# Altium project TIK_SIMULATIONS.PrjPcb
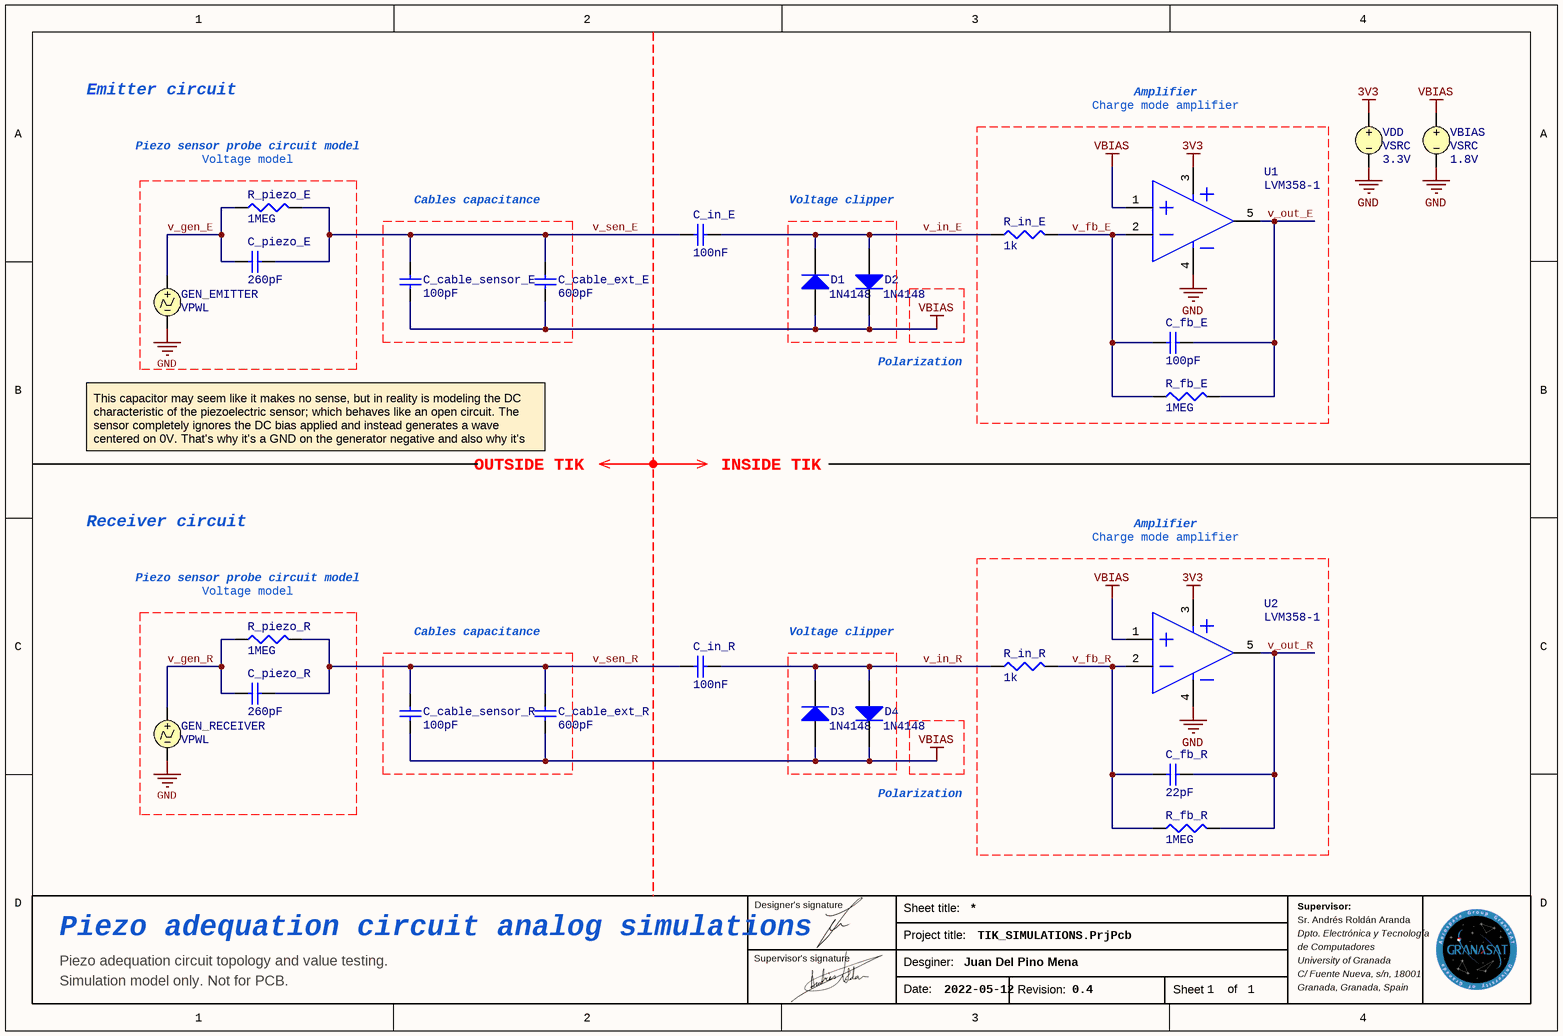
[diagram p0: conditioning_circuit.SchDoc]
ProjectAuthor: Juan Del Pino Mena; ProjectDate: 2022-05-12; ProjectRevision: 0.4
1 sheet, 26 parts. Net scope: global (net labels, ports and power ports of the same name join across sheets).

## Sheet conditioning_circuit.SchDoc
size A4; SheetNumber: 1; SheetTotal: 1; TitleBig: Piezo adequation circuit analog simulations; Desc_line1: Piezo adequation circuit topology and value testing.; Desc_line2: Simulation model only. Not for PCB.; SPICEModelCacheTSNVVPPP: <root> / <DocumentId>TSNVVPPP</DocumentId> / <CacheFrame Number="0"> / <Model Name="lmv358" Kind="ckt"> / <Text>.SUBCKT  lmv358     3  2  4  5  6 / * Features: / * 2.7V and 5V Operation / * Low Supply Current:  105uA per Channel at VCC=5V / * Stable for AV = +1 / * Note:  Model is for single device only and simulated / *	 supply current is 1/2 of the total device current. / *///////////////////////////////////////// / ************************************** / EOX 120 10 31 32 2.0 / RCX 120 121 1K / RDX 121 10 1K / RBX 120 122 1K / GOS 10 57 122 121 1.0 / RVOS 31 32 1K / RINB 2 18 1000 / RINA 3 19 1000 / DIN1 5 18 DMOD2 / DIN2 18 4 DMOD2 / DIN3 5 19 DMOD2 / DIN4 19 4 DMOD2 / EXX 10 5 17 5 1.0 / EEE 10 50 17 5 1.0 / ECC 40 10 4 17 1.0 / RAA 4 17 100MEG / RBB 17 5 100MEG / ISET 10 24 1e-3 / DA1 24 23 DMOD1 / RBAL 23 22 1000 / ESUPP 22 21 4 5 1.0 / VOFF 21 10 -1.25 / DA2 24 25 DMOD1 / VSENS1 25 26 DC 0 / RSET 26 10 1K / CSET 26 10 1e-10 / FSET 10 31 VSENS1 1.0 / R001 34 10 1K / FTEMP 10 27 VSENS1 1.0 / DTA 27 10 DMOD2 / DTB 28 29 DMOD2 / VTEMP 29 10 DC 0 / ECMR 38 10 11 10 1.0 / VCMX 38 39 DC 0 / RCM2 41 10 1MEG / EPSR 42 10 4 10 1.0 / CDC1 43 42 10U / VPSX 43 44 DC 0 / RPSR2 45 10 1MEG / FCXX 57 10 VCXX 100 / DCX1 98 97 DMOD1 / DCX2 95 94 DMOD1 / RCX1 99 98 100 / RCX2 94 99 100 / VCXX 99 96 DC 0 / ECMX 96 10 11 10 1.0 / DLIM1 52 57 DMOD1 / DLIM2 57 51 DMOD1 / ELIMP 51 10 26 10 99.3 / GDM 10 57 3 2 1 / C1 58 59 1e-10 / DCLMP2 59 40 DMOD1 / DCLMP1 50 59 DMOD1 / RO2 59 10 1K / GO3 10 71 59 10 1 / RO3 71 10 1 / DDN1 73 74 DMOD1 / DDN2 73 710 DMOD1 / DDP1 75 72 DMOD1 / DDP2 71 720 DMOD1 / RDN2 710 71 100 / RDP 720 72 100 / VOOP 40 76 DC 0 / VOON 77 50 DC 0 / QNO 76 73 78 NPN1 / QNP 77 72 79 PNP1 / RNO 78 81 1 / RPO 79 81 1 / VOX 86 6 DC 0 / RNT 76 81 100MEG / RPT 81 77 1MEG / FX 10 93 VOX 1.0 / DFX1 93 91 DMOD1 / VFX1 91 10 DC 0 / DFX2 92 93 DMOD1 / VFX2 10 92 DC 0 / FPX 4 10 VFX1 1.0 / FNX 10 5 VFX2 1.0 / RAX 122 10 MRAX 1.014000e+03 / * Input Offset Voltage / .MODEL MRAX RES (TC1=1e-05) / FIN1 18 5 VTEMP 0.833333 / FIN2 19 5 VTEMP 1.16667 / * Input Bias Currents / CIN1 2 10 1e-12 / CIN2 3 10 1e-12 / * Common Mode Input Capacitance / RD1 18 11 5e+08 / RD2 19 11 5e+08 / * Diff. Input Resistance / RCM 11 10 9.75e+09 / * Common Mode Input Resistance / FCMR 10 57 VCMX 562.341 / * Low Freq. CMRR / FPSR 10 57 VPSX 2000 / * Low Freq. PSRR / RSLOPE 4 5 1e+12 / * Slope of Supp. Curr. vs. Supp. Volt. / GPWR 4 5 26 10 0.000105 / * Quiescent Supply Current / ETEMP 27 28 32 33 0.286906 / RIB 32 33 MRIB 1K / * Temp. Co. of Input Currents / .MODEL MRIB RES (TC1=0.00283713) / RISC 33 34 MRISC 1K / .MODEL MRISC RES (TC1=-0.003) / RCM1 39 41 17782.8 / CCM 41 10 5.30516e-12 / * CMRR vs. Freq. / RPSR1 44 45 10000 / CPSR 45 10 5.30516e-11 / * PSRR vs. Freq. / ELIMN 10 52 26 10 99.3 / RDM 57 10 725.52 / C2 57 10 1.09683e-10 / ECMP 40 97 26 10 0.8 / ECMN 95 50 26 10 0.2 / G2 58 10 57 10 1e-06 / R2 58 10 1378.32 / GO2 59 10 58 10 100 / * Avol and Slew-Rate Settings / EPOS 40 74 26 10 0 / ENEG 75 50 26 10 0.01 / * Output Voltage Swing Settings / GSOURCE 74 73 33 34 0.0006 / GSINK 72 75 33 34 0.0016 / * Output Current Settings / ROO 81 86 8.5 / .MODEL DMOD1 D / .MODEL DMOD2 D  (IS=1e-17) / .MODEL NPN1 NPN (BF=100 IS=1e-15) / .MODEL PNP1 PNP (BF=100 IS=1e-15) / .ENDS lmv358</Text> / </Model> / </CacheFrame> / <CacheFrame Number="1"> / <Model Name="lmv358" Kind="ckt"> / <Text>.SUBCKT  lmv358     3  2  4  5  6 / * Features: / * 2.7V and 5V Operation / * Low Supply Current:  105uA per Channel at VCC=5V / * Stable for AV = +1 / * Note:  Model is for single device only and simulated / *    supply current is 1/2 of the total device current. / *///////////////////////////////////////// / ************************************** / EOX 120 10 31 32 2.0 / RCX 120 121 1K / RDX 121 10 1K / RBX 120 122 1K / GOS 10 57 122 121 1.0 / RVOS 31 32 1K / RINB 2 18 1000 / RINA 3 19 1000 / DIN1 5 18 DMOD2 / DIN2 18 4 DMOD2 / DIN3 5 19 DMOD2 / DIN4 19 4 DMOD2 / EXX 10 5 17 5 1.0 / EEE 10 50 17 5 1.0 / ECC 40 10 4 17 1.0 / RAA 4 17 100MEG / RBB 17 5 100MEG / ISET 10 24 1e-3 / DA1 24 23 DMOD1 / RBAL 23 22 1000 / ESUPP 22 21 4 5 1.0 / VOFF 21 10 -1.25 / DA2 24 25 DMOD1 / VSENS1 25 26 DC 0 / RSET 26 10 1K / CSET 26 10 1e-10 / FSET 10 31 VSENS1 1.0 / R001 34 10 1K / FTEMP 10 27 VSENS1 1.0 / DTA 27 10 DMOD2 / DTB 28 29 DMOD2 / VTEMP 29 10 DC 0 / ECMR 38 10 11 10 1.0 / VCMX 38 39 DC 0 / RCM2 41 10 1MEG / EPSR 42 10 4 10 1.0 / CDC1 43 42 10U / VPSX 43 44 DC 0 / RPSR2 45 10 1MEG / FCXX 57 10 VCXX 100 / DCX1 98 97 DMOD1 / DCX2 95 94 DMOD1 / RCX1 99 98 100 / RCX2 94 99 100 / VCXX 99 96 DC 0 / ECMX 96 10 11 10 1.0 / DLIM1 52 57 DMOD1 / DLIM2 57 51 DMOD1 / ELIMP 51 10 26 10 99.3 / GDM 10 57 3 2 1 / C1 58 59 1e-10 / DCLMP2 59 40 DMOD1 / DCLMP1 50 59 DMOD1 / RO2 59 10 1K / GO3 10 71 59 10 1 / RO3 71 10 1 / DDN1 73 74 DMOD1 / DDN2 73 710 DMOD1 / DDP1 75 72 DMOD1 / DDP2 71 720 DMOD1 / RDN2 710 71 100 / RDP 720 72 100 / VOOP 40 76 DC 0 / VOON 77 50 DC 0 / QNO 76 73 78 NPN1 / QNP 77 72 79 PNP1 / RNO 78 81 1 / RPO 79 81 1 / VOX 86 6 DC 0 / RNT 76 81 100MEG / RPT 81 77 1MEG / FX 10 93 VOX 1.0 / DFX1 93 91 DMOD1 / VFX1 91 10 DC 0 / DFX2 92 93 DMOD1 / VFX2 10 92 DC 0 / FPX 4 10 VFX1 1.0 / FNX 10 5 VFX2 1.0 / RAX 122 10 MRAX 1.014000e+03 / * Input Offset Voltage / .MODEL MRAX RES (TC1=1e-05) / FIN1 18 5 VTEMP 0.833333 / FIN2 19 5 VTEMP 1.16667 / * Input Bias Currents / CIN1 2 10 1e-12 / CIN2 3 10 1e-12 / * Common Mode Input Capacitance / RD1 18 11 5e+08 / RD2 19 11 5e+08 / * Diff. Input Resistance / RCM 11 10 9.75e+09 / * Common Mode Input Resistance / FCMR 10 57 VCMX 562.341 / * Low Freq. CMRR / FPSR 10 57 VPSX 2000 / * Low Freq. PSRR / RSLOPE 4 5 1e+12 / * Slope of Supp. Curr. vs. Supp. Volt. / GPWR 4 5 26 10 0.000105 / * Quiescent Supply Current / ETEMP 27 28 32 33 0.286906 / RIB 32 33 MRIB 1K / * Temp. Co. of Input Currents / .MODEL MRIB RES (TC1=0.00283713) / RISC 33 34 MRISC 1K / .MODEL MRISC RES (TC1=-0.003) / RCM1 39 41 17782.8 / CCM 41 10 5.30516e-12 / * CMRR vs. Freq. / RPSR1 44 45 10000 / CPSR 45 10 5.30516e-11 / * PSRR vs. Freq. / ELIMN 10 52 26 10 99.3 / RDM 57 10 725.52 / C2 57 10 1.09683e-10 / ECMP 40 97 26 10 0.8 / ECMN 95 50 26 10 0.2 / G2 58 10 57 10 1e-06 / R2 58 10 1378.32 / GO2 59 10 58 10 100 / * Avol and Slew-Rate Settings / EPOS 40 74 26 10 0 / ENEG 75 50 26 10 0.01 / * Output Voltage Swing Settings / GSOURCE 74 73 33 34 0.0006 / GSINK 72 75 33 34 0.0016 / * Output Current Settings / ROO 81 86 8.5 / .MODEL DMOD1 D / .MODEL DMOD2 D  (IS=1e-17) / .MODEL NPN1 NPN (BF=100 IS=1e-15) / .MODEL PNP1 PNP (BF=100 IS=1e-15) / .ENDS lmv358</Text> / </Model> / </CacheFrame> / </root>

### Parts
C_cable_ext_E  value 600pF  [C1206]  (hidden comment: Cap Semi)
C_cable_ext_R  value 600pF  [C1206]  (hidden comment: Cap Semi)
C_cable_sensor_E  value 100pF  [C1206]  (hidden comment: Cap Semi)
C_cable_sensor_R  value 100pF  [C1206]  (hidden comment: Cap Semi)
C_fb_E  value 100pF  [C1206]  (hidden comment: Cap Semi)
C_fb_R  value 22pF  [C1206]  (hidden comment: Cap Semi)
C_in_E  value 100nF  [C1206]  (hidden comment: Cap Semi)
C_in_R  value 100nF  [C1206]  (hidden comment: Cap Semi)
C_piezo_E  value 260pF  [C1206]  (hidden comment: Cap Semi)
C_piezo_R  value 260pF  [C1206]  (hidden comment: Cap Semi)
D1  1N4148  [DO-35]
D2  1N4148  [DO-35]
D3  1N4148  [DO-35]
D4  1N4148  [DO-35]
GEN_EMITTER  VPWL
GEN_RECEIVER  VPWL
R_fb_E  value 1MEG  [J1-0603]  (hidden comment: Res3)
R_fb_R  value 1MEG  [J1-0603]  (hidden comment: Res3)
R_in_E  value 1k  [J1-0603]  (hidden comment: Res3)
R_in_R  value 1k  [J1-0603]  (hidden comment: Res3)
R_piezo_E  value 1MEG  [J1-0603]  (hidden comment: Res3)
R_piezo_R  value 1MEG  [J1-0603]  (hidden comment: Res3)
U1  Part: LVM358-1  (hidden comment: LMV358)
U2  Part: LVM358-1  (hidden comment: LMV358)
VBIAS  VSRC  value 1.8V
VDD  VSRC  value 3.3V

### Blocks framed on the sheet
Charge mode amplifier: C_fb_E R_fb_E R_in_E U1
Voltage model: C_piezo_E GEN_EMITTER R_piezo_E
Cables capacitance: C_cable_ext_E C_cable_sensor_E
Voltage clipper: D1 D2
Charge mode amplifier: C_fb_R R_fb_R R_in_R U2
Voltage model: C_piezo_R GEN_RECEIVER R_piezo_R
Cables capacitance: C_cable_ext_R C_cable_sensor_R
Voltage clipper: D3 D4

### Nets
3V3: U1.3(VSUP+) U2.3(VSUP+) VDD.1
GND: GEN_EMITTER.2 GEN_RECEIVER.2 U1.4(VSUP-) U2.4(VSUP-) VBIAS.2 VDD.2
VBIAS: C_cable_ext_E.1 C_cable_ext_R.1 C_cable_sensor_E.1 C_cable_sensor_R.1 D1.1(A) D2.2(K) D3.1(A) D4.2(K) U1.1(VIN+) U2.1(VIN+) VBIAS.1
v_fb_E: C_fb_E.1 R_fb_E.1 R_in_E.2 U1.2(VIN-)
v_fb_R: C_fb_R.1 R_fb_R.1 R_in_R.2 U2.2(VIN-)
v_gen_E: C_piezo_E.1 GEN_EMITTER.1 R_piezo_E.1
v_gen_R: C_piezo_R.1 GEN_RECEIVER.1 R_piezo_R.1
v_in_E: C_in_E.2 D1.2(K) D2.1(A) R_in_E.1
v_in_R: C_in_R.2 D3.2(K) D4.1(A) R_in_R.1
v_out_E: C_fb_E.2 R_fb_E.2 U1.5(VOUT)
v_out_R: C_fb_R.2 R_fb_R.2 U2.5(VOUT)
v_sen_E: C_cable_ext_E.2 C_cable_sensor_E.2 C_in_E.1 C_piezo_E.2 R_piezo_E.2
v_sen_R: C_cable_ext_R.2 C_cable_sensor_R.2 C_in_R.1 C_piezo_R.2 R_piezo_R.2

### Notes on the sheet
- Emitter circuit
- Amplifier
- Piezo sensor probe circuit model
- Polarization
- This capacitor may seem like it makes no sense, but in reality is modeling the DC characteristic of the piezoelectric sensor; which behaves like an open circuit. The sensor completely ignores the DC bias applied and instead generates a wave centered on 0V. That's why it's a GND on the generator negative and also why it's needed a coupling capacitor C_in.
- OUTSIDE TIK
- INSIDE TIK
- Receiver circuit
- Designer's signature
- Sheet title:
- Sr. Andrés Roldán Aranda
- Supervisor:
- Supervisor's signature
- Project title:
- Desginer:
- Dpto. Electrónica y Tecnología
- de Computadores
- University of Granada
- C/ Fuente Nueva, s/n, 18001
- Granada, Granada, Spain
- Date:
- Revision:
- Sheet
- of

### Library data of the parts
C_cable_ext_E C_cable_ext_R C_cable_sensor_E C_cable_sensor_R C_fb_E C_fb_R C_in_E C_in_R C_piezo_E C_piezo_R = Cap Semi: Capacitor (Semiconductor SIM Model); Published: 8-Jun-2000; LatestRevisionDate: 29-May-2009; LatestRevisionNote: IPC-7351 Footprint Added.; PackageReference: C1206; Publisher: Altium Limited; PackageDescription: Chip Capacitor
D1-D4 = Diode 1N4148: High Conductance Fast Diode; Published: 8-Jun-2000; LatestRevisionDate: 17-Jul-2002; LatestRevisionNote: Re-released for DXP Platform.; DatasheetVersion: 1997; PackageReference: DO-35; Publisher: Altium Limited; PackageDescription: Diode, Axial; Body 3.8 x 1.9 mm (LxDia. max), Lead Dia. 0.53 mm (max); Code_JEDEC: DO-204-AH; ComponentLink1Description: Manufacturer Link; ComponentLink1URL: http://www.fairchildsemi.com/; ComponentLink2Description: Datasheet; ComponentLink2URL: http://www.fairchildsemi.com/ds/1N%2F1N4148.pdf
GEN_EMITTER GEN_RECEIVER = VPWL: Piecewise Linear Voltage Source; Note: PCB Footprint - Not required; Sim Note: To add model file containing time-current pairs of values, enter model location under "General Tab" in "Full Path" box.; Published: 8-Jun-2000; LatestRevisionDate: 17-Jul-2002; LatestRevisionNote: Re-released for DXP Platform.; PackageReference: Not Applicable; Publisher: Altium Limited
R_fb_E R_fb_R R_in_E R_in_R R_piezo_E R_piezo_R = Res3: Resistor; Published: 8-Jun-2000; LatestRevisionDate: 29-May-2009; LatestRevisionNote: IPC-7351 Footprint Added.; PackageReference: J1-0603; Publisher: Altium Limited; PackageDescription: Chip Resistor
VBIAS VDD = VSRC: Voltage Source; Note: PCB Footprint - Not required; AC Magnitude: 1; AC Phase: 0; Published: 30-July-2020; LatestRevisionDate: 30-July-2020; LatestRevisionNote: Re-released for DXP Platform.; PackageReference: Not Applicable; Publisher: Altium Limited